# EAGLE design emonDCduo-ESP v1.1c (EAGLE 8.3.2)
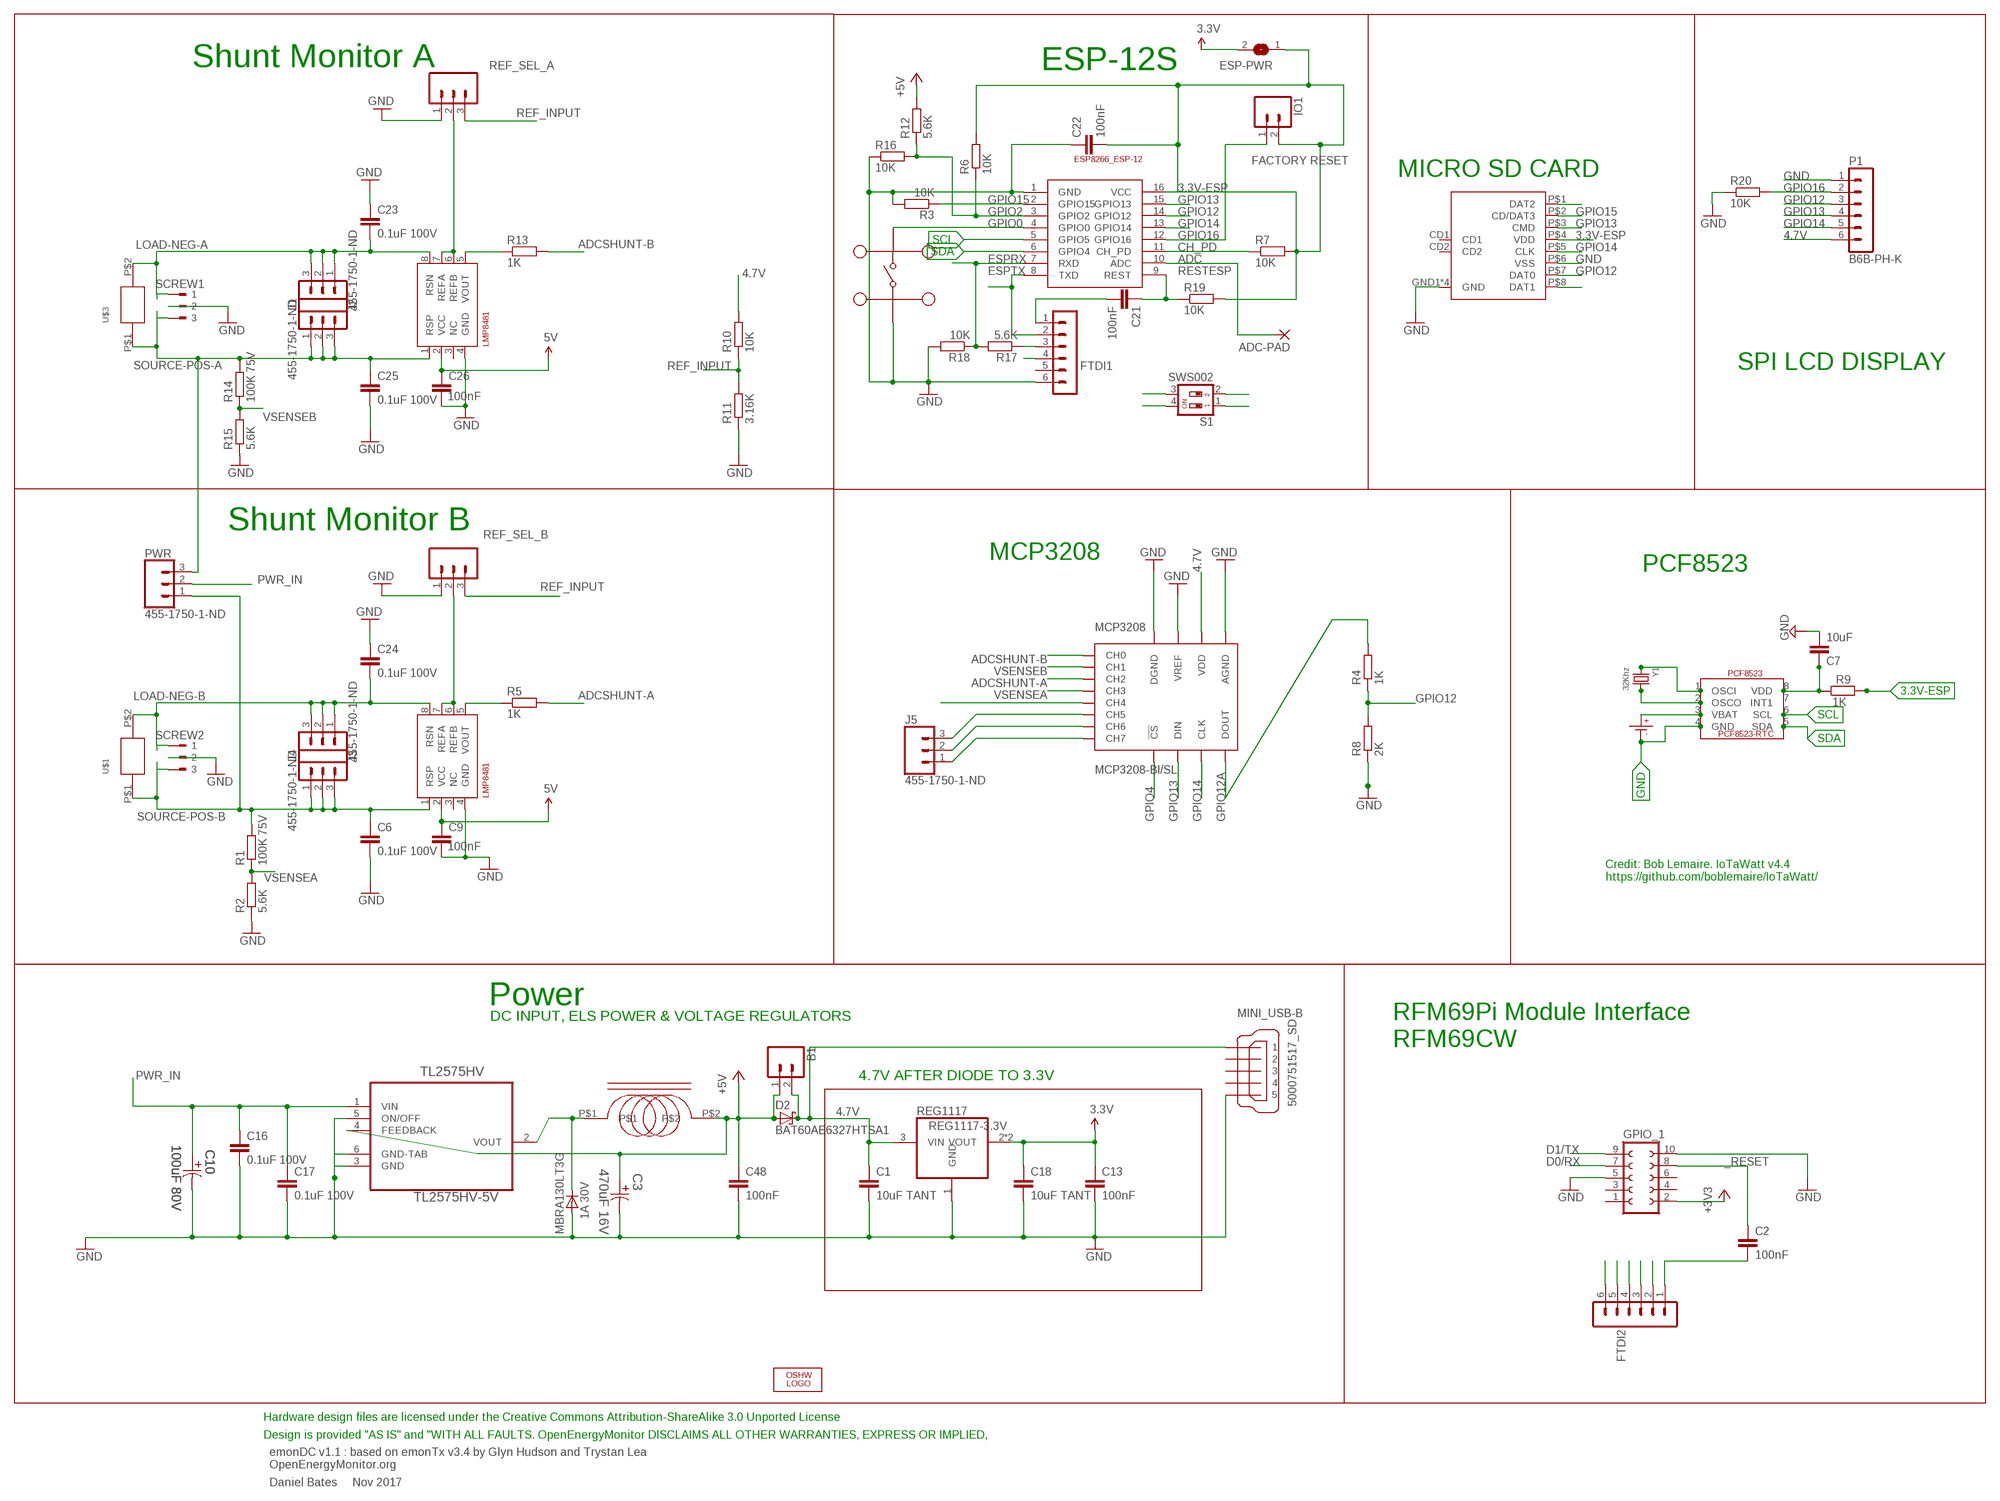
[diagram p0: schematic, sheet 1]

## Parts
ADC-PAD  2,15/1,0  [2,15/1,0]
B1  M02PTH  [1X02]
C1  10uF TANT  C-EUC0603  [C0603]
C2  100nF  C-EUC0603  [C0603]
C3  470uF 16V  EEE-FK1C471P-CASE-F  [CAPAE830X1050N]
C6  0.1uF 100V  C-EUC0603  [C0603]
C7  10uF  C-EUC0603  [C0603]
C9  100nF  C-EUC0603  [C0603]
C10  100uF 80V  EEV-FK1K101Q-CASE-H13  [CAPAE1350X1400N]
C13  100nF  C-EUC0603  [C0603]
C16  0.1uF 100V  C-EUC0603  [C0603]
C17  0.1uF 100V  C-EUC0603  [C0603]
C18  10uF TANT  C-EUC0603  [C0603]
C21  100nF  C-EUC0603  [C0603]
C22  100nF  C-EUC0603  [C0603]
C23  0.1uF 100V  C-EUC0603  [C0603]
C24  0.1uF 100V  C-EUC0603  [C0603]
C25  0.1uF 100V  C-EUC0603  [C0603]
C26  100nF  C-EUC0603  [C0603]
C48  100nF  C-EUC0603  [C0603]
CR1220  CR1220SMD  [CR1220SMD]
D1  MBRA130LT3G  [DO-214]
D2  BAT60AE6327HTSA1  BAT60J  [SOD323_ST]
ESP-12  ESP8266_ESP-12  [ESP8266-ESP12]
ESP-PWR  SJ  [SJ]
FTDI1  FTDI  MA06-1  [MA06-1]
FTDI2  FTDI  MA06-1  [MA06-1]
GPIO_1  FE05-2  [FE05-2]
I1  330uH  SRR0603-331KL  [SRR0603-331KL]
IO1  M02PTH  [1X02]
J1  455-1750-1-ND  CONN_03  [1X03]
J2  455-1750-1-ND  CONN_03  [1X03]
J3  455-1750-1-ND  CONN_03  [1X03]
J4  455-1750-1-ND  CONN_03  [1X03]
J5  455-1750-1-ND  CONN_03  [1X03]
LOGO1  OSHW_LOGO_6MILX0200-NT  [OSHW_6X200_NOTEXT]
MC2  MC32882  [SWITCH_TACT_MULTICOMP]
MCP3208  MCP3208-BI/SL  [SOIC16]
MINI_USB-B  5000751517_SD  [5000751517_SD]
P1  B6B-PH-K  [B6B-PH-K]
PCF8523  PCF8523_RTC  [SOIC_8]
PWR  455-1750-1-ND  CONN_03  [1X03]
R1  100K 75V  R-EU_R0603  [R0603]
R2  5.6K  R-EU_R0603  [R0603]
R3  10K  R-EU_R0603  [R0603]
R4  1K  R-EU_R0603  [R0603]
R5  1K  R-EU_R0603  [R0603]
R6  10K  R-EU_R0603  [R0603]
R7  10K  R-EU_R0603  [R0603]
R8  2K  R-EU_R0603  [R0603]
R9  1K  R-EU_R0603  [R0603]
R10  10K  R-EU_0309/12  [0309/12]
R11  3.16K  R-EU_0309/12  [0309/12]
R12  5.6K  R-EU_R0603  [R0603]
R13  1K  R-EU_R0603  [R0603]
R14  100K 75V  R-EU_R0603  [R0603]
R15  5.6K  R-EU_R0603  [R0603]
R16  10K  R-EU_R0603  [R0603]
R17  5.6K  R-EU_R0603  [R0603]
R18  10K  R-EU_R0603  [R0603]
R19  10K  R-EU_R0603  [R0603]
R20  10K  R-EU_R0603  [R0603]
REF_SEL_A  455-1750-1-ND  CONN_03  [1X03]
REF_SEL_B  455-1750-1-ND  CONN_03  [1X03]
REG1117  REG1117-3.3V  REG1117-VOUT4  [SOT223]
S1  SWS002  [SMS-002]
SCREW1  180-3  [180-3]
SCREW2  180-3  [180-3]
SHUNTMON-A  LMP8481  LMP8481-H  [S-PDSO-G08]
SHUNTMON-B  LMP8481  LMP8481-H  [S-PDSO-G08]
TL2575HV  TL2575HV-5V  TL2575HV-05IKTTR  [TO-263]
U$1  EBW_SERIES_10.5MM  [EBW_SERIES_10.5MM]
U$2  MOLEX_MICRO_SD_1040310811  [MOLEX_MICROSD_EXPOSED]
U$3  EBW_SERIES_10.5MM  [EBW_SERIES_10.5MM]
Y1  32Khz  CRYSTAL8X3.8SMT  [CRYSTAL_8X3.8]

## Nets
3.3V: C13.1 C18.1 ESP-PWR.2 GPIO_1.2 REG1117.2(VOUT) REG1117.4(VOUT) ; supply symbol labelled +3V3
3.3V-ESP: C22.2 ESP-12.16(VCC) ESP-PWR.1 IO1.2 R6.2 R7.2 R9.2 R19.2 U$2.P$4(VDD)
4.7V [power]: B1.2 C1.1 C9.1 C26.1 D2.C FTDI1.4 FTDI2.4 MCP3208.16(VDD) MINI_USB-B.VBUS P1.6 R10.2 REG1117.3(VIN) SHUNTMON-A.2(VCC) SHUNTMON-B.2(VCC) ; supply symbol labelled 5V
+5V: B1.1 C3.1 C48.1 D2.A I1.P$2 R12.2 TL2575HV.4(FEEDBACK)
_RESET: C2.1 GPIO_1.8
ADC: ADC-PAD.1(P) ESP-12.10(ADC)
ADCSHUNT-A: MCP3208.3(CH2) R5.2
ADCSHUNT-B: MCP3208.1(CH0) R13.2
CH_PD: ESP-12.11(CH_PD) R7.1
D0/RX: FTDI2.2 GPIO_1.7 S1.2
D1/TX: FTDI2.3 GPIO_1.9 S1.1
ESPRX: ESP-12.7(RXD) R17.2 R18.1 S1.4
ESPTX: ESP-12.8(TXD) FTDI1.2 S1.3
GND [thin_power]: C1.2 C3.2 C6.2 C7.2 C9.2 C10.2 C13.2 C16.2 C17.2 C18.2 C22.1 C23.1 C24.1 C25.2 C26.2 C48.2 CR1220.P-(P$-) D1.P$2(A) ESP-12.1(GND) FTDI1.6 FTDI2.6 GPIO_1.5 GPIO_1.10 MC2.P$1 MC2.P$2 MCP3208.9(DGND) MCP3208.14(AGND) MCP3208.15(VREF) MINI_USB-B.GND1 MINI_USB-B.GND2 MINI_USB-B.GND3 P1.1 PCF8523.4(GND) R2.1 R3.2 R8.1 R11.1 R15.1 R16.1 R18.2 R20.1 REF_SEL_A.1 REF_SEL_B.1 REG1117.1(GND) SCREW1.2 SCREW2.2 SHUNTMON-A.4(GND) SHUNTMON-B.4(GND) TL2575HV.3(GND) TL2575HV.5(ON/OFF) TL2575HV.6(GND-TAB) U$2.GND1(GND) U$2.GND2(GND) U$2.GND3(GND) U$2.GND4(GND) U$2.P$6(VSS)
GPIO0: ESP-12.4(GPIO0) MC2.P$3 MC2.P$4
GPIO2: ESP-12.3(GPIO2) R6.1 R12.1 R16.2
GPIO4: MCP3208.10(!CS)
GPIO12: ESP-12.14(GPIO12) P1.3 R4.1 R8.2 U$2.P$7(DAT0)
GPIO12A: MCP3208.12(DOUT) R4.2
GPIO13: ESP-12.15(GPIO13) MCP3208.11(DIN) P1.4 U$2.P$3(CMD)
GPIO14: ESP-12.13(GPIO14) MCP3208.13(CLK) P1.5 U$2.P$5(CLK)
GPIO15 [thin_power]: ESP-12.2(GPIO15) R3.1 U$2.P$2(CD/DAT3)
GPIO16: ESP-12.12(GPIO16) IO1.1 P1.2 R20.2
IND: D1.P$1(C) I1.P$1 TL2575HV.2(VOUT)
LOAD-NEG-A: C23.2 J1.1 J1.2 J1.3 SCREW1.1 SHUNTMON-A.8(RSN) U$3.P$2
LOAD-NEG-B: C24.2 J4.1 J4.2 J4.3 SCREW2.1 SHUNTMON-B.8(RSN) U$1.P$2
N$3: J5.3 MCP3208.6(CH5)
N$4: R13.1 SHUNTMON-A.5(VOUT)
N$5: J5.2 MCP3208.7(CH6)
N$6: R5.1 SHUNTMON-B.5(VOUT)
N$7: U$2.P$1(DAT2)
N$9: J5.1 MCP3208.8(CH7)
N$10: C7.1 PCF8523.8(VDD) R9.1
N$20: FTDI2.5
N$30: C21.2 FTDI1.1
N$32: U$2.P$8(DAT1)
N$36: FTDI1.3 R17.1
N$43: CR1220.P+(P$+) PCF8523.3(VBAT)
N$44: PCF8523.2(OSCO) Y1.P$4
N$45: PCF8523.1(OSCI) Y1.P$1
N$301: C2.2 FTDI2.1
PWR_IN: C10.1 C16.1 C17.1 PWR.2 TL2575HV.1(VIN)
REF_A_INPUT: REF_SEL_A.2 SHUNTMON-A.6(REFB) SHUNTMON-A.7(REFA)
REF_B_INPUT [thin_power]: REF_SEL_B.2 SHUNTMON-B.6(REFB) SHUNTMON-B.7(REFA)
REF_INPUT: MCP3208.5(CH4) R10.1 R11.2 REF_SEL_A.3 REF_SEL_B.3
RESTESP: C21.1 ESP-12.9(REST) R19.1
SCL: ESP-12.5(GPIO5) PCF8523.6(SCL)
SDA: ESP-12.6(GPIO4) PCF8523.5(SDA)
SOURCE-POS-A: C25.1 J2.1 J2.2 J2.3 PWR.3 R14.2 SCREW1.3 SHUNTMON-A.1(RSP) U$3.P$1
SOURCE-POS-B: C6.1 J3.1 J3.2 J3.3 PWR.1 R1.2 SCREW2.3 SHUNTMON-B.1(RSP) U$1.P$1
VSENSEA: MCP3208.4(CH3) R1.1 R2.2
VSENSEB: MCP3208.2(CH1) R14.1 R15.2
Unconnected: FTDI1.5 GPIO_1.1 GPIO_1.3 GPIO_1.4 GPIO_1.6 MINI_USB-B.D+ MINI_USB-B.D- MINI_USB-B.ID PCF8523.7(INT1) SHUNTMON-A.3(NC) SHUNTMON-B.3(NC) U$2.CD1 U$2.CD2

## Notes on the sheet
- Shunt Monitor A | ESP-12S
- FACTORY RESET
- MICRO SD CARD
- SPI LCD DISPLAY
- Shunt Monitor B
- MCP3208
- PCF8523
- Credit: Bob Lemaire. IoTaWatt v4.4
  https://github.com/boblemaire/IoTaWatt/
- Power
- DC INPUT, ELS POWER & VOLTAGE REGULATORS
- RFM69Pi Module Interface
  RFM69CW
- 4.7V AFTER DIODE TO 3.3V
- Hardware design files are licensed under the Creative Commons Attribution-ShareAlike 3.0 Unported License
- Design is provided "AS IS" and "WITH ALL FAULTS. OpenEnergyMonitor DISCLAIMS ALL OTHER WARRANTIES, EXPRESS OR IMPLIED,
- emonDC v1.1 : based on emonTx v3.4 by Glyn Hudson and Trystan Lea
  OpenEnergyMonitor.org
- Daniel Bates     Nov 2017

## Library data of the parts
ADC-PAD = wirepad:2,15/1,0: THROUGH-HOLE PAD
B1 IO1 = SparkFun:M02: Header 2 Standard 2-pin 0.1" header. Use with straight break away headers (SKU : PRT-00116), right angle break away headers (PRT-00553), swiss pins (PRT-00743), machine pins (PRT-00117), and female headers (PRT-00115). Molex polarized connector foot print use with SKU : PRT-08233 with associated crimp pins and housings.
C1 C2 C7 C13 C16-C18 C21 C22 C48 = rcl:C-EU: CAPACITOR, European symbol
C3 = Panasonic-EEEFK_EEEFP:EEE-: Aluminum Electrolytic Capacitors,Surface Mount Type; MPN: EEE-FK1C471P; OC_FARNELL: 9695710; OC_NEWARK: 96K9385; PACKAGE: CASE-F; SUPPLIER: PANASONIC; TOLERANCE: ±20 %; VALUE: 470UF; VOLTAGERATING: 16V
C6 C9 C23-C26 = rcl:C-EU: CAPACITOR, European symbol; MPN: C1608X7S2A104K080AB
C10 = Panasonic-EEE-EEV-EEF-ECQ:EEV-: Aluminum Electrolytic Capacitors,Surface Mount Type; MPN: EEVFK1K101Q; OC_FARNELL: 9696113; OC_NEWARK: 96K9484; SUPPLIER: PANASONIC; TOLERANCE: ±20 %; VALUE: 100UF; VOLTAGERATING: 80V
CR1220 = IotaWatt_parts:CR1220SMD: CR1220 Battery SMD
D1 = CASE 403D Diode:MBRA130LT3G: Fast switching diode; MF: ON SEMICONDUCTOR; MPN: MBRA130LT3G; OC_FARNELL: 9555978
D2 = diode:BAT60J: Schottky barrier diode Source: www.st.com, BAT60J.pdf
ESP-12 = ESP8266-ESP12:ESP8266_ESP-12
ESP-PWR = jumper:SJ: SMD solder JUMPER
FTDI1 FTDI2 = JeeLabs:MA06-1: PIN HEADER
GPIO_1 = con-lsta:FE05-2: FEMALE HEADER; OC_FARNELL: unknown; OC_NEWARK: unknown
I1 = SRR0603-331KL:SRR0603-331KL: SRR0603-331KL; INDUCTANCE: 330uH; MF: BOURNS; MPN: SRR0603-331KL; OC_FARNELL: 2333890
J1-J5 PWR = SparkFun-Connectors:CONN_03: Multi connection point. Often used as Generic Header-pin footprint for 0.1 inch spaced/style header connections On any of the 0.1 inch spaced packages, you can populate with these: Break Away Headers - Straight <https://www.sparkfun.com/products/116> (PRT-00116) Break Away Male Headers - Right Angle <https://www.sparkfun.com/products/553> (PRT-00553) Female Headers <https://www.sparkfun.com/products/115> (PRT-00115) Break Away Headers - Machine Pin <https://www.sparkfun.com/products/117> (PRT-00117) Break Away Female Headers - Swiss Machine Pin <https://www.sparkfun.com/products/743> (PRT-00743) Stackable Header - 3 Pin (Female, 0.1") <https://www.sparkfun.com/products/13875> (PRT-13875) For SCREWTERMINALS and SPRING TERMINALS visit here: Screw Terimnals on SparkFun.com <https://www.sparkfun.com/search/results?term=Screw+Terminals> (5mm/3.5mm/2.54mm spacing) This device is also useful as a general connection point to wire up your design to another part of your project. Our various solder wires solder well into these plated through hole pads. Hook-Up Wire - Assortment (Stranded, 22 AWG) <https://www.sparkfun.com/products/11375> (PRT-11375) Hook-Up Wire - Assortment (Solid Core, 22 AWG) <https://www.sparkfun.com/products/11367> (PRT-11367) View the entire wire category on our website here <https://www.sparkfun.com/categories/141> Special notes: Molex polarized connector foot print use with SKU : PRT-08232 with associated crimp pins and housings.; PROD_ID: XXX-00000
LOGO1 = ohw-logo:OSHW_LOGO_6MIL; OC_FARNELL: unknown
MC2 = multicomp tact switch:MC32882
MCP3208 = MCP3208:MCP3208
MINI_USB-B = 5000751517_sd:5000751517_SD
P1 = jst-ph:B6B-PH-K: HEADER
PCF8523 = IotaWatt_parts:PCF8523_RTC: PCF8523-RTC SOIC-8
R1 R14 = rcl:R-EU_: RESISTOR, European symbol; MPN: MCWR06X1003FTL
R2 R4 R8 R15 = rcl:R-EU_: RESISTOR, European symbol; MPN: MCWR06X5901FTL
R3 R5-R7 R9-R13 R16-R20 = rcl:R-EU_: RESISTOR, European symbol
REF_SEL_A REF_SEL_B = SparkFun-Connectors:CONN_03: Multi connection point. Often used as Generic Header-pin footprint for 0.1 inch spaced/style header connections On any of the 0.1 inch spaced packages, you can populate with these: Break Away Headers - Straight <https://www.sparkfun.com/products/116> (PRT-00116) Break Away Male Headers - Right Angle <https://www.sparkfun.com/products/553> (PRT-00553) Female Headers <https://www.sparkfun.com/products/115> (PRT-00115) Break Away Headers - Machine Pin <https://www.sparkfun.com/products/117> (PRT-00117) Break Away Female Headers - Swiss Machine Pin <https://www.sparkfun.com/products/743> (PRT-00743) Stackable Header - 3 Pin (Female, 0.1") <https://www.sparkfun.com/products/13875> (PRT-13875) For SCREWTERMINALS and SPRING TERMINALS visit here: Screw Terimnals on SparkFun.com <https://www.sparkfun.com/search/results?term=Screw+Terminals> (5mm/3.5mm/2.54mm spacing) This device is also useful as a general connection point to wire up your design to another part of your project. Our various solder wires solder well into these plated through hole pads. Hook-Up Wire - Assortment (Stranded, 22 AWG) <https://www.sparkfun.com/products/11375> (PRT-11375) Hook-Up Wire - Assortment (Solid Core, 22 AWG) <https://www.sparkfun.com/products/11367> (PRT-11367) View the entire wire category on our website here <https://www.sparkfun.com/categories/141> Special notes: Molex polarized connector foot print use with SKU : PRT-08232 with associated crimp pins and housings.; MF: MULTICOMP; MPN: 2212S-02SG-85; OC_FARNELL: 1593458; PROD_ID: XXX-00000
REG1117 = burr-brown:REG1117-VOUT4: 800mA and 1A Low Dropout (LDO) Positive Regulator 1.8V, 2.5V, 2.85V, 3.3V, 5V, and Adj; MF: TEXAS INSTRUMENTS; MPN: REG1117; OC_FARNELL: 1097566; OC_NEWARK: 14P6981
S1 = smd-special:SWS002: SMD Dip Switch 2 pol.
SCREW1 SCREW2 = con-weidmueller-sl35:180-3: WEIDMUELLER CLAMP CONNECTOR; OC_FARNELL: unknown; OC_NEWARK: unknown
SHUNTMON-A = lmp8481b:LMP8481: LMP8481MM-H/NOPB 100V/V; MF: TEXAS INSTRUMENTS; MPN: LMP8481MME-S/NOPB; OC_FARNELL: 2322044
SHUNTMON-B = lmp8481b:LMP8481: LMP8481MM-H/NOPB 100V/V; MF: TEXAS INSTRUMENTS; MPN: LMP8481MME-H/NOPB; OC_FARNELL: 2322044
TL2575HV = TL2575HV:TL2575HV; MF: TEXAS INSTRUMENTS; MPN: LM2575HVS-15/NOPB; OC_FARNELL: 2492609
U$1 U$3 = EBW series shunt:EBW_SERIES_10.5MM
U$2 = MOLEX MICRO SD [exposed pins]:MOLEX_MICRO_SD_1040310811
Y1 = microbuilder:CRYSTAL: Crystals HC49UP - Surface Mount Crystal 4.0MHz 18pF +/-30ppm Surface Mount Crystal [Digikey: 535-9857-1-ND] 12.0 MHz Surface Mount Crystal [Digikey: 535-9869-6-ND] 25.0 MHz Surface Mount Crystal [Digikey: 535-9078-1-ND] 2.5 x 2.0mm - MEMs SMT Crystal 16.0 MHz 10pF 20ppm 2.5 x 2.0mm Crystal [Digikey -40-85°C: 535-10923-1-ND] 3.2 x 2.5mm - MEMs SMT Crystal 12.0 MHz 8pF 15ppm 3.2 x 2.5mm Crystal [Digikey: -10-70°C: 644-1047-1-ND -40-125°C: 644-1128-1-ND] 16.0 MHz 8pF 15ppm 3.2 x 2.5mm Crystal [Digikey: -10-70°C: 644-1049-1-ND -40-125°C: 644-1129-2-ND] 16.0 MHz 10pF 10ppm 3.2 x 2.5mm Crystal [Digikey: 644-1100-1-ND] 27.12 MHz 18pF 30ppm 3.2 x 2.5mm Crystal [Digikey: 887-1424-1-ND] 27.12MHz 10pF 10ppm 3.2 x 2.5mm Crystal [Digikey: 887-1329-1-ND] 4.9 x 1.8mm - MEMs SMT Crystal 32.768 KHz 12.5pF 20ppm 4.9 x 1.8mm Crystal [Digikey: SE2415CT-ND] 8.0 x 3.8mm - Surface Mount Crystal 32.768kHz 12.5pF 20ppm -40°C-85°C [Digikey: 535-9166-2-ND] Cylinder 32.768KHz Cylinder Crystal (2x6mm body) [Ex. Digikey: 300-8341-2-ND]

## Net classes
2 thin_power: width 0.254 mm

## Board
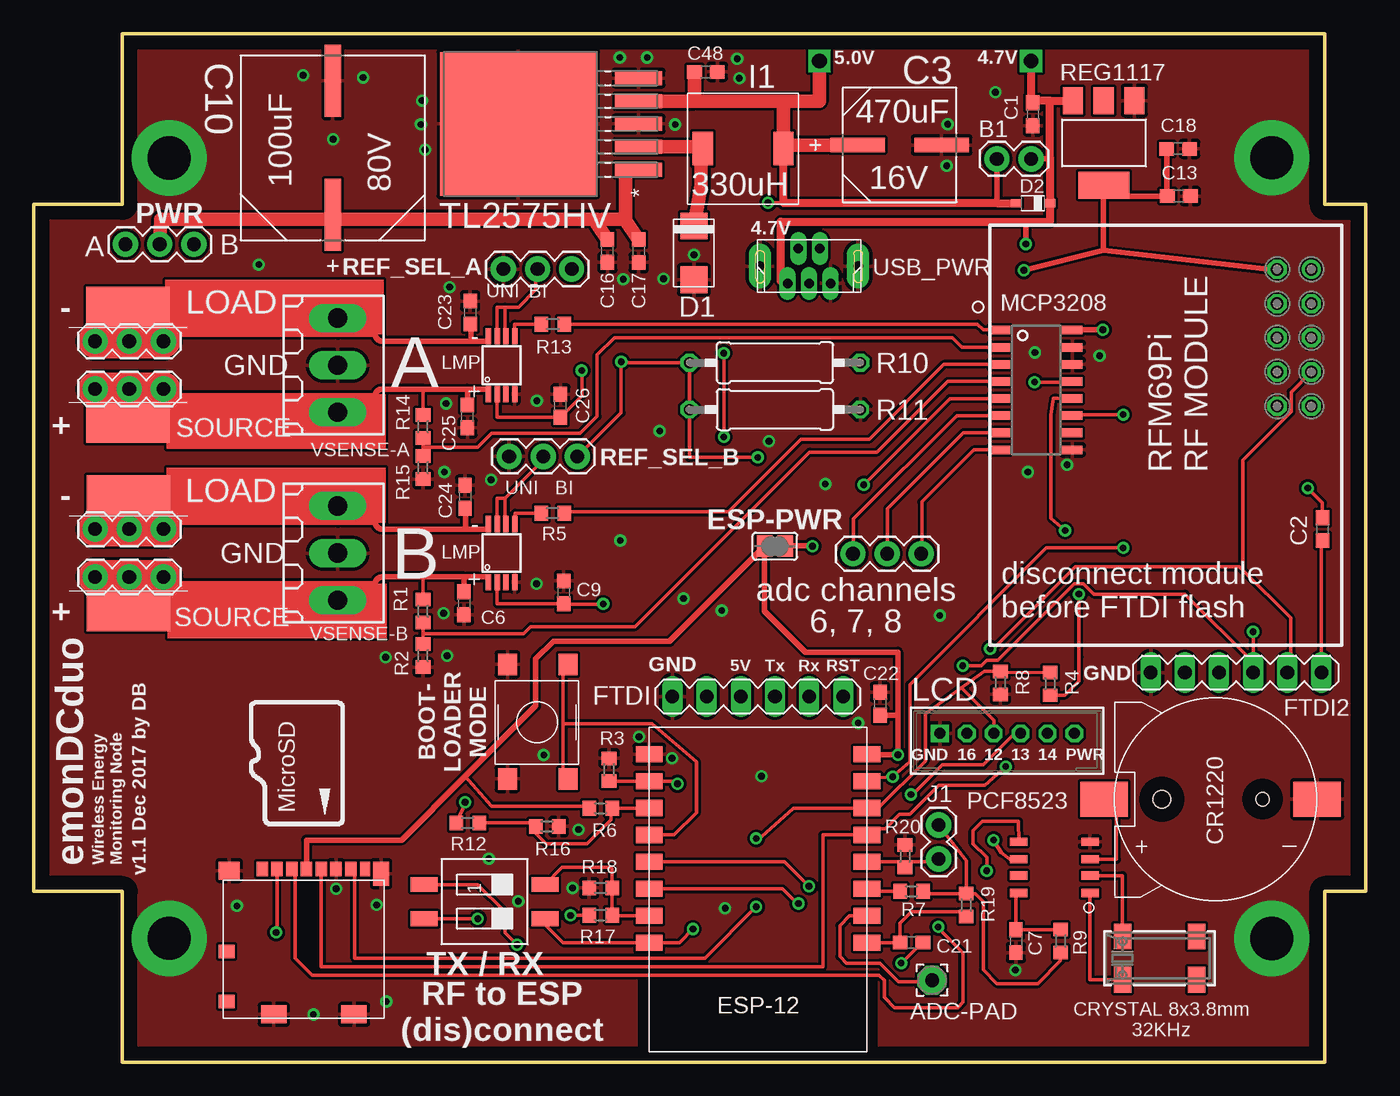
[diagram p1: board, top side]
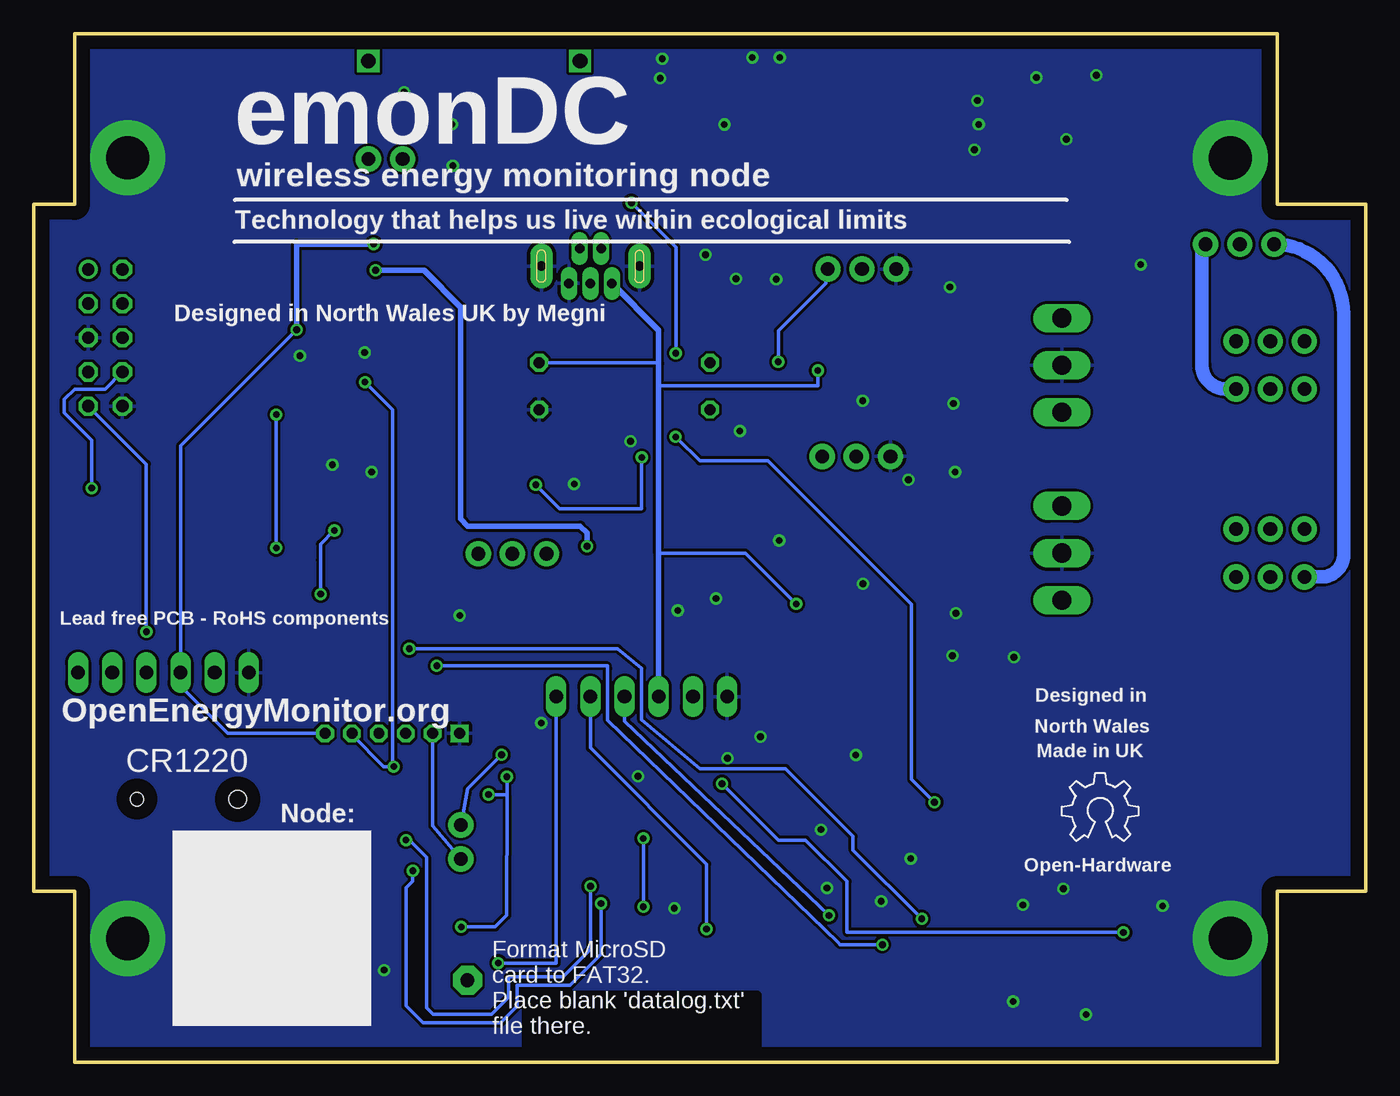
[diagram p2: board, bottom side, seen from below]

Size 99.06 x 76.45 mm. Coordinates in mm from the lower left corner, seen from the top.
Outline: 6.6,63.75 6.6,76.45 96.01,76.45 96.01,63.75 99.06,63.75 99.06,12.7 96.01,12.7 96.01,0 6.6,0 6.6,12.7 0,12.7 0,63.75 6.6,63.75
Copper layers (1*16): Top 0.035mm / dielectric 1.5mm / Bottom 0.035mm
Design rules "default *": minimum track width 10mil, minimum drill 19mil, track to track 8mil, track to pad 8mil, pad to pad 8mil, via to via 8mil, smd to smd 8mil, copper to edge 40mil, drill to drill 8mil, minimum pad ring 10mil, minimum via ring 8mil, stop-mask expansion 4mil, vias tented up to drill 0mil, thermal gap 10mil
tRestrict: area 45.2,1 to 62.5,6.1
bRestrict: area 45.2,1 to 62.5,5.1

### Footprints (pad centres in the part's own frame; a part is rotated, then mirrored left to right if it is on the bottom)
2,15/1,0 = drill 1.016 pad 2.159 octagon: 1 0,0
1X02 = drill 1.016 pad 1.88: 1 0,0; 2 2.54,0
C0603 = smd 1.1 x 1: 1 -0.85,0; 2 0.85,0
CAPAE830X1050N = smd 4.064 x 1.092: 1 -3.124,0; 2 3.124,0
CAPAE1350X1400N = smd 5.359 x 1.194: 1 -4.978,0; 2 4.978,0
CR1220SMD = smd 3.54 x 2.6: P+ 8.3,0; P- -7.55,0 | hole 1: -3.5,0 | hole 1.3: 4,0
DO-214 = smd 2 x 2: P$1 -2,0; P$2 2,0
SOD323_ST = smd 0.8 x 0.6: A 1.25,0; C -1.25,0
ESP8266-ESP12 = smd 2 x 1.2: 1 16.2,2; 2 16.2,4; 3 16.2,6; 4 16.2,8; 5 16.2,10; 6 16.2,12; 7 16.2,14; 8 16.2,16; 9 0,16; 10 0,14; 11 0,12; 12 0,10; 13 0,8; 14 0,6; 15 0,4; 16 0,2
SJ = smd 1.168 x 1.6: 1 -0.762,0; 2 0.762,0
MA06-1 = drill 1.016 long: 1 0,0; 2 2.54,0; 3 5.08,0; 4 7.62,0; 5 10.16,0; 6 12.7,0
FE05-2 = drill 0.914: 1 -5.08,1.27 | drill 0.914 octagon: 2 -5.08,-1.27; 3 -2.54,1.27; 4 -2.54,-1.27; 5 0,1.27; 6 0,-1.27; 7 2.54,1.27; 8 2.54,-1.27; 9 5.08,1.27; 10 5.08,-1.27
SRR0603-331KL = smd 1.5 x 2.5: P$1 -3,0; P$2 3,0
1X03 = drill 1.016 pad 1.88: 1 0,0; 2 2.54,0; 3 5.08,0
SWITCH_TACT_MULTICOMP = smd 1.6 x 1.4: P$1 -1.1,5.3; P$2 7.4,5.3; P$3 -1.1,0.8; P$4 7.4,0.8
SOIC16 = smd 0.635 x 1.524: 1 -4.445,-2.695; 2 -3.175,-2.695; 3 -1.905,-2.695; 4 -0.635,-2.695; 5 0.635,-2.695; 6 1.905,-2.695; 7 3.175,-2.695; 8 4.445,-2.695; 9 4.445,2.695; 10 3.175,2.695; 11 1.905,2.695; 12 0.635,2.695; 13 -0.635,2.695; 14 -1.905,2.695; 15 -3.175,2.695; 16 -4.445,2.695
5000751517_SD = drill 0.7 pad 1.016 long: D+ 0,-1.3; D- -0.8,1.3; GND1 1.6,-1.3; ID 0.8,1.3; VBUS -1.6,-1.3 | drill 0.7 pad 1.676 long: GND2 3.65,0; GND3 -3.65,0
B6B-PH-K = drill 0.813 square: 1 -5,0 | drill 0.813 octagon: 2 -3,0; 3 -1,0; 4 1,0; 5 3,0; 6 5,0
SOIC_8 = smd 1.3 x 0.6: 1 -2.6,1.9; 2 -2.6,0.6; 3 -2.6,-0.6; 4 -2.6,-1.9; 5 2.7,-1.9; 6 2.7,-0.6; 7 2.7,0.6; 8 2.7,1.9
R0603 = smd 1 x 1.1: 1 -0.85,0; 2 0.85,0
0309/12 = drill 0.813 octagon: 1 -6.35,0; 2 6.35,0
SOT223 = smd 1.499 x 2.007: 1 -2.261,-3.15; 2 0.025,-3.15; 3 2.311,-3.15 | smd 3.81 x 2.007: 4 0,3.15
SMS-002 = smd 1.092 x 2.007: 1 -1.27,-4.496; 2 1.27,-4.496; 3 1.27,4.496; 4 -1.27,4.496
180-3 = drill 1.422 long: 1 -3.5,0; 2 0,0; 3 3.5,0
S-PDSO-G08 = smd 0.4 x 1.2: 1 -0.975,-2.157; 2 -0.325,-2.157; 3 0.325,-2.157; 4 0.975,-2.157; 5 0.975,2.157; 6 0.325,2.157; 7 -0.325,2.157; 8 -0.975,2.157
TO-263 = smd 1.041 x 3.505: 1 -3.404,-8.788; 2 -1.702,-8.788; 3 0,-8.788; 4 1.702,-8.788; 5 3.404,-8.788 | smd 10.668 x 11.659: 6 0,0.152
EBW_SERIES_10.5MM = smd 3 x 6.2: P$1 -4.3,0; P$2 4.3,0
MOLEX_MICROSD_EXPOSED = smd 1.195 x 1.005: CD1 5.349,0.435; CD2 5.349,4.135 | smd 1.907 x 1.348: GND1 -4.112,5.104; GND2 1.853,5.104 | smd 1.17 x 1.793: GND3 -6.134,-5.352 | smd 1.551 x 1.348: GND4 5.167,-5.577 | smd 0.851 x 1.092: P$1 2.707,-5.703; P$2 1.617,-5.703; P$3 0.522,-5.699; P$4 -0.586,-5.701; P$5 -1.676,-5.703; P$6 -2.769,-5.703; P$7 -3.875,-5.701 | smd 0.749 x 1.092: P$8 -4.935,-5.701
CRYSTAL_8X3.8 = smd 1.3 x 1.9: P$1 -2.75,-1.6; P$2 2.75,-1.6; P$3 2.75,1.6; P$4 -2.75,1.6

### Placement (x,y rotation side)
ADC-PAD  66.8,6.1 0 top
B1  71.63,67.14 0 top
C1  74.3,70.46 270 top
C2  95.83,39.63 270 top
C3  64.39,68.17 0 top
C6  32,34.11 270 top
C7  73.04,9 270 top
C9  39.42,34.93 90 top
C10  22.25,67.96 90 top
C13  85.15,64.38 0 top
C16  42.66,60.3 270 top
C17  44.99,60.3 270 top
C18  85.1,67.89 0 top
C21  65.28,8.89 0 top
C22  62.94,26.64 270 top
C23  32.46,55.73 270 top
C24  32.08,42.04 270 top
C25  32.26,48.01 270 top
C26  39.17,48.8 90 top
C48  49.99,73.61 0 top
CR1220  87.88,19.56 180 top
D1  49.09,60.16 270 top
D2  74.31,63.85 180 top
ESP-12  61.98,24.89 180 top
ESP-PWR  55.12,38.35 0 top
FTDI1  60.2,27.18 180 top
FTDI2  95.76,28.96 180 top
GPIO_1  93.73,53.85 270 top
I1  52.76,67.91 0 top
IO1  67.29,15.1 90 top
J1  4.57,53.59 0 top
J2  4.57,50.04 0 top
J3  4.57,36.07 0 top
J4  4.57,39.62 0 top
J5  66,37.79 180 top
LOGO1  22.6,16.43 0 bottom
MC2  40.53,22.17 90 top
MCP3208  74.54,49.96 270 top
MINI_USB-B  57.66,59.18 0 top
P1  72.39,24.44 0 top
PCF8523  75.95,14.48 180 top
PWR  6.84,60.8 0 top
R1  28.96,33.53 90 top
R2  28.96,30.23 90 top
R3  42.79,21.74 90 top
R4  75.57,28.13 270 top
R5  38.6,40.81 0 top
R6  42.16,18.87 180 top
R7  65.28,12.7 0 top
R8  71.88,28.19 90 top
R9  76.36,9.01 270 top
R10  55.12,52 0 top
R11  55.12,48.51 180 top
R12  32.28,17.78 180 top
R13  38.61,54.86 0 top
R14  28.96,47.24 90 top
R15  28.96,44.2 90 top
R16  38.19,17.53 180 top
R17  42.16,10.92 0 top
R18  42.16,12.95 180 top
R19  69.34,11.68 90 top
R20  64.79,15.31 270 top
REF_SEL_A  34.92,58.95 0 top
REF_SEL_B  35.35,45.03 0 top
REG1117  79.58,68.33 180 top
S1  33.53,11.94 270 top
SCREW1  22.61,51.82 270 top
SCREW2  22.61,37.85 270 top
SHUNTMON-A  34.8,51.82 0 top
SHUNTMON-B  34.8,37.85 0 top
TL2575HV  36.19,69.74 90 top
U$1  7.05,37.82 90 top
U$2  19.71,8.66 180 top
U$3  7.02,51.83 90 top
Y1  83.71,7.73 0 top

### Tracks (layer width: path | path; a pad name or v marks a point on that pad's centre or on a via)
3.3V  (via drill 0.5)
  Top 0.254: 55.94,38.39 ESP-PWR.2 | 92.46,58.86 GPIO_1.2
  Top 0.406: REG1117.2 79.54,71.48 | 79.54,60.37 92.46,58.86 | 79.54,60.37 v73.63,58.86 | C18.1 84.25,64.44 C13.1 79.58,64.38 REG1117.4 79.54,65.13 79.54,60.37 | v57.91,38.35 57.88,38.39 55.94,38.39
  Bottom 0.406: v73.63,58.86 70.04,58.86 67.31,56.13 67.31,40.39 66.78,39.85 58.42,39.85 57.91,39.34 v57.91,38.35
3.3V-ESP  (via drill 0.5)
  Top 0.254: R7.2 66.13,12.53 R19.2 | R6.2 40.89,19.04 34.05,19.04 32.09,21.25 | IO1.2 69.34,14.99 R19.2 | R19.2 70.02,12.53 70.61,11.94 70.61,6.86 71.63,5.84 74.68,5.84 76.36,7.53 R9.2
  Top 0.406: 64.26,25.91 64.26,30.48 57.4,30.48 54.36,33.53 ESP-PWR.1 47.29,31.28 38.65,31.28 37.34,29.97 37.34,26.49 32.09,21.25 27.35,16.51 20.3,16.51 U$2.P$4 | 64.26,25.91 v64.26,22.86 62.01,22.86 ESP-12.16 | C22.2 64.15,25.8 64.26,25.91
  Bottom 0.254: v64.26,22.86 66.8,20.32 IO1.2
4.7V  (via drill 0.5, 1.1)
  Top 0.254: SHUNTMON-A.2 34.47,47.95 C26.1 40.76,49.54 40.76,51.36 40.75,51.36 v40.75,51.41 | SHUNTMON-B.2 34.47,34.08 C9.1 39.46,34.04 42.42,34.04 42.39,34.07 v42.36,34.07
  Top 0.406: D2.C 75.74,64.1 | 74.17,71.31 C1.1 74.3,71.48 | 75.56,62.48 73.79,62.48 v73.79,60.81 | v79.5,54.44 77.27,54.44 MCP3208.16 | MINI_USB-B.VBUS 55.86,58.08 55.56,58.08 | B1.2 75.4,67.14 75.56,67.31
  Top 0.61: v74.17,74.42 74.17,71.31 | 75.56,71.48 75.56,67.31 D2.C 75.56,62.48 55.56,62.48 55.56,58.08 | 75.56,71.48 REG1117.3 | 75.56,71.48 74.3,71.48
  Bottom 0.254: 40.85,51.31 v40.75,51.41 40.75,50.29 52.58,50.29 52.58,51.94 52.58,52 R10.2 | v42.36,34.07 46.14,37.85 52.58,37.85 | v79.5,54.44 88.14,45.81 FTDI2.4 88.14,27.94 84.64,24.44 P1.6
  Bottom 0.406: v79.5,54.44 79.5,60.81 v73.79,60.81 | FTDI1.4 52.58,37.85 52.58,51.94 52.58,54.4 MINI_USB-B.VBUS
+5V  (via drill 0.5, 1.1)
  Top 0.254: v54.61,63.88 55.72,63.88 55.76,63.85 | R12.2 32.07,19.16 v32.08,19.33 | v51.32,46.48 51.32,52.69 v51.31,52.7
  Top 0.406: B1.1 71.63,63.85
  Top 0.61: D2.A 71.63,63.85 55.76,63.85 I1.P$2
  Top 1.016: TL2575HV.4 49.14,71.44 | 49.14,71.44 C48.1 | 55.76,71.44 I1.P$2 55.5,68.17 C3.1 | 55.76,71.44 49.14,71.44 | v58.42,74.42 58.42,71.44 55.76,71.44
  Bottom 0.254: v51.32,46.48 51.18,46.36 49.53,44.7 44.45,44.7 33.78,34.04 33.78,21.03 v32.08,19.33 | v51.31,52.7 51.31,60.58 v54.61,63.88
_RESET  (via drill 0.5)
  Top 0.254: C2.1 95.83,41.58 v94.74,42.67
  Bottom 0.254: v94.74,42.67 94.74,46.23 96.77,48.26 96.77,49.28 96.01,50.04 93.73,50.04 GPIO_1.8
ADC
  Top 0.254: ESP-12.10 60.68,10.89 59.94,10.16 59.94,7.87 60.45,7.37 62.93,7.37 64.3,5.99 66.7,5.99 ADC-PAD.1
ADCSHUNT-A
  Top 0.254: R5.2 39.43,40.93 51.66,40.93 57.05,46.32 62.14,46.32 67.69,51.88 71.82,51.88 MCP3208.3
ADCSHUNT-B
  Top 0.254: R13.2 70.18,54.86 70.6,54.44 71.81,54.44 MCP3208.1
CH_PD
  Top 0.254: ESP-12.11 61.98,12.7 R7.1
D0/RX  (via drill 0.5)
  Top 0.254: S1.2 v33.02,10.67 | v71.12,30.73 71.37,30.73 77.47,36.83 89.66,36.83 89.92,36.58 | 89.92,36.58 93.47,33.02 93.47,29.21 FTDI2.2 | GPIO_1.7 93.5,49.81 93.5,48.34 89.92,44.76 89.92,36.58
  Bottom 0.254: v33.02,10.67 38.13,15.77 38.13,16.79 43.16,21.82 49.52,21.82 53.86,25.46 53.86,29.29 55.63,30.73 v71.12,30.73
D1/TX  (via drill 0.5)
  Top 0.254: v69.09,29.46 70.47,29.46 70.88,29.87 71.69,29.87 77.4,35.58 78.05,35.58 78.82,34.8 85.6,34.8 90.68,29.72 FTDI2.3 v90.68,32 | v35.95,8.74 35.05,9.64 35.05,11.18 33.02,13.21 S1.1
  Bottom 0.254: v69.09,29.46 56.39,29.46 56.38,29.26 56.38,25.43 39.22,8.87 39.1,8.74 v35.95,8.74 | v90.68,32 90.68,44.45 GPIO_1.9
ESPRX
  Top 0.254: ESP-12.7 42.79,10.89 R17.2 R18.1 43.01,14.39 42.93,14.48 39.29,14.48 S1.4
ESPTX  (via drill 0.5)
  Top 0.254: S1.3 38.02,10.24 39.37,8.89 ESP-12.8 48.01,8.89 v49.02,9.91
  Bottom 0.254: v49.02,9.91 49.02,14.73 57.66,23.37 FTDI1.2
GND  (via drill 0.5, 3.2 pad 5.59)
  Top 0.254: ESP-12.1 46.06,22.61
  Top 0.406: U$2.GND2 | U$2.P$6 22.48,14.39 | 25.86,13.97 25.91,13.97 25.96,14.02
  other vias: 10.08,67.21 92.07,67.23 52.47,73.15 10.08,9.2 92.07,9.2 30.49,33.36 16.74,59.28 30.55,43.87 37.41,49.17 71.51,72.1 30.66,48.96 37.39,35.57 47.47,22.6 51.42,11.44 22.49,12.89 43.84,58.2 67.97,69.73 47.7,69.7 28.88,71.47 20.04,73.36 24.49,73.2 26.18,30.11 30.74,30.22 34.01,43.3 20.81,3.54 49.09,60.02 45.02,24.2 25.51,11.7 61.31,25.22 15.12,11.62 30.93,57.61 37.93,22.83 26.23,4.51 46.83,58.24 67.88,66.63 52.32,74.58 29.11,67.83 28.79,69.71 43.59,74.69 45.62,74.69 22.27,68.6 43.63,38.79 48.33,34.47 51.17,33.58 67.38,33.2 54.12,21.26 73.93,43.87 79.27,52.5 74.44,52.76 76.85,44.42 54.68,46.15 72.99,6.85 46.55,46.91 58.87,42.98 40.08,12.95 40.52,17.29 36.04,11.96 33.84,15.13
  pour Bottom (isolate 0.127): 6.86,76.2 6.86,63.5 0.25,63.5 0.25,12.95 6.86,12.95 6.86,0.25 95.76,0.25 95.76,12.95 98.81,12.95 98.81,63.5 95.76,63.5 95.76,76.2
  pour Top (isolate 0.127): 6.86,76.2 6.86,63.5 0.25,63.5 0.25,12.95 6.86,12.95 6.86,0.25 95.76,0.25 95.76,12.95 98.81,12.95 98.81,63.5 95.76,63.5 95.76,76.2
GPIO0
  Top 0.254: ESP-12.4 47.63,16.89 49.28,18.54 49.28,22.35 45.97,25.15 39.37,25.15 | 39.37,25.15 39.37,29.21 39.73,29.21 MC2.P$4 | 39.37,25.15 39.37,21.59 39.73,21.59 MC2.P$3
GPIO2
  Top 0.254: R16.2 | R16.2 37.34,17.02 38.1,16.26 41.15,16.26 42.93,18.03 42.93,18.78 R6.1 45.76,18.87 ESP-12.3 | R12.1 37.08,17.78 R16.2
GPIO12  (via drill 0.5)
  Top 0.254: R4.1 71.97,28.96 R8.2 70.7,29.04 68.99,27.83 | 68.99,27.83 66.29,25.91 66.29,22.38 62.77,18.86 61.98,18.86 ESP-12.14 56.48,18.89 53.78,16.45 | 53.78,16.45 53.59,16.51 | v53.72,11.56 49.91,7.75 23.88,7.75 23.88,14.1 U$2.P$7 | v53.72,16.64 53.85,16.64 53.78,16.45 | P1.3 71.39,25.42 68.99,27.83
  Bottom 0.254: v53.72,16.64 v53.72,11.56
GPIO12A  (via drill 0.5)
  Top 0.254: 77.22,49.34 MCP3208.12 76.1,49.34 75.83,49.34 75.64,48.14 75.64,40.45 76.69,39.52 v76.7,39.52 | v77.72,34.79 77.72,30.14 77.72,30.13 77.72,28.32 76.68,27.28 R4.2
  Bottom 0.254: v76.7,39.52 77.72,38.5 77.72,37.34 v77.72,34.79
GPIO13  (via drill 0.48, 0.5)
  Top 0.254: U$2.P$3 19.43,14.1 19.43,7.75 20.7,6.48 62.87,6.48 63.25,6.1 63.25,4.83 64.01,4.06 68.71,4.06 69.09,4.45 69.09,8.13 67.26,9.95 v67.26,10.06 | ESP-12.15 61.98,21.08 v63.87,21.22 65.15,22.35 65.15,28.07 75.31,38.23 v81.03,38.23 | v81.03,48.13 77.72,48.13 MCP3208.11 | v65.23,19.89 65.36,19.89 67.56,22.1 70.63,22.1 72.86,24.33 73.28,24.33 P1.4
  Bottom 0.254: 63.87,19.81 63.88,10.92 64.75,10.06 v67.26,10.06 | 63.87,19.81 v63.87,21.22 | v81.03,38.23 v81.03,48.13 | v65.23,19.89 63.96,19.89 63.87,19.81
GPIO14  (via drill 0.48)
  Top 0.254: ESP-12.13 58.67,16.89 58.67,7.11 21.39,7.11 U$2.P$5 | v74.42,50.55 77.22,50.55 MCP3208.13 | ESP-12.13 | v72.28,21.97 70.74,20.57 67.31,20.57 65.15,18.42 64.39,18.42 63.34,17.36 62.44,17.36 ESP-12.13
  Bottom 0.254: P1.5 75.39,24.34 73.02,21.97 v72.28,21.97 72.38,21.97 72.38,24.02 72.38,24.03 72.38,48.51 v74.42,50.55
GPIO15  (via drill 0.5)
  Top 0.254: ESP-12.2 R3.1 47.88,20.89 v47.88,20.7 | v18.03,9.65 18.09,9.65 U$2.P$2
  Bottom 0.254: v18.03,9.65 38.58,9.65 38.58,13.44 41.66,16.51 43.69,16.51 v47.88,20.7
GPIO16
  Top 0.254: IO1.1 66.71,14.89 64.95,14.89 | 64.95,14.89 ESP-12.12 | R20.2 64.95,14.62 64.95,14.89
  Bottom 0.254: P1.2 69.39,17.57 IO1.1
IND
  Top 1.016: TL2575HV.2 49.63,68.04 | 49.63,68.04 I1.P$1 | 49.63,68.04 49.63,65.1 D1.P$1
LOAD-NEG-A
  Top 0.406: 32.51,53.59 33.82,53.59 SHUNTMON-A.8 | C23.2 32.51,54.88 32.51,53.59 | 9.68,53.57 J1.3 arc-90 10.16,54.1 22.61,54.1 | SCREW1.1 22.61,54.1 | 22.61,54.1 25.4,54.1 arc90 25.91,53.59 32.51,53.59
  Top 2.54: J1.1 J1.2 | J1.2 J1.3 | U$3.P$2 7.02,53.69 J1.2
LOAD-NEG-B
  Top 0.406: 32.12,39.62 33.82,39.62 SHUNTMON-B.8 | C24.2 32.12,41.19 32.12,39.62 | J4.1 J4.2 J4.3 arc-90 10.16,40.13 22.61,40.13 | SCREW2.1 22.61,40.13 | 22.61,40.13 25.4,40.13 arc90 25.91,39.62 32.12,39.62
  Top 2.54: J4.1 J4.3 9.68,39.6 | J4.2 7.11,42.06 U$1.P$2
N$3
  Top 0.254: MCP3208.6 68.63,48.06 60.96,40.39 60.96,37.39 J5.3
N$4
  Top 0.254: SHUNTMON-A.5 35.77,54.86 R13.1
N$5
  Top 0.254: MCP3208.7 69.14,46.79 63.5,41.15 63.5,37.39 J5.2
N$6
  Top 0.254: SHUNTMON-B.5 35.81,40.81 R5.1
N$9
  Top 0.254: MCP3208.8 69.9,45.52 66.04,41.66 66.04,37.39 J5.1
N$10
  Top 0.254: R9.1 73.05,9.86 C7.1 73.04,12.53 PCF8523.8
N$30  (via drill 0.5)
  Top 0.254: v64.52,7.37 66.04,8.89 C21.2
  Bottom 0.254: FTDI1.1 60.2,7.37 v64.52,7.37
N$36  (via drill 0.5)
  Top 0.254: R17.1 v39.92,10.91
  Bottom 0.254: v39.92,10.91 55.12,25.36 FTDI1.3
N$43
  Top 0.254: PCF8523.3 80.52,15.08 80.52,19.3 79.58,19.3 CR1220.P+
N$44
  Top 0.254: PCF8523.2 80.96,13.88 Y1.P$4
N$45
  Top 0.254: PCF8523.1 78.55,6.13 Y1.P$1
N$301
  Top 0.254: FTDI2.1 95.76,38.35 95.83,38.43 C2.2
PWR_IN
  Top 1.016: 44.27,66.33 TL2575HV.1 44.01,66.33 44.01,62.66 43.94,62.66 | PWR.2 9.46,62.66 21.93,62.66 | 43.94,62.66 42.29,62.66 41.9,62.27 | C16.1 41.9,62.27 | C17.1 43.97,62.63 43.94,62.66 | 21.93,62.66 C10.1 | 41.9,62.27 41.9,62.66 21.93,62.66
REF_A_INPUT
  Top 0.254: 35.05,56.13 35.05,54.04 SHUNTMON-A.6 | SHUNTMON-A.7 34.47,56.13 35.05,56.13 | 35.05,56.13 36.07,56.13 37.34,57.4 37.34,58.83 REF_SEL_A.2
REF_B_INPUT
  Top 0.254: REF_SEL_B.2 37.93,44.79 35.05,41.91 | 35.05,41.91 35.05,40.07 SHUNTMON-B.6 | SHUNTMON-B.7 34.47,41.91 35.05,41.91
REF_INPUT  (via drill 0.5)
  Top 0.254: v43.69,52.07 43.69,48.26 40.46,45.03 REF_SEL_B.3 | 43.69,52.32 v43.69,52.07 | v43.69,52.07 44.01,52.07 44.01,52 R10.1 R11.2 48.77,44.96 v53.85,44.96 | MCP3208.5 68.12,49.33 v61.72,42.93
  Bottom 0.254: v43.69,52.07 43.69,54.36 40.13,57.91 40.13,58.83 REF_SEL_A.3 | v61.72,42.93 59.94,41.15 53.85,41.15 v53.85,44.96
RESTESP
  Top 0.254: ESP-12.9 C21.1 64.43,10.33 65.28,11.18 69,11.18 R19.1
SCL  (via drill 0.5)
  Top 0.254: ESP-12.5 55.85,14.89 v57.66,13.08 | v71.37,16.51 71.94,15.57 72.58,15.08 PCF8523.6
  Bottom 0.254: v57.66,13.08 57.66,8.38 59.69,6.35 63.75,6.35 63.75,4.83 65.02,3.56 69.34,3.56 69.85,4.06 69.85,15.24 71.12,16.51 v71.37,16.51
SDA  (via drill 0.5)
  Top 0.254: ESP-12.6 55.69,12.89 56.64,11.94 56.77,11.9 v56.87,11.8 | v70.87,14.22 70.87,15.24 69.85,16.26 69.85,17.21 70.55,17.91 73.24,17.91 PCF8523.5
  Bottom 0.254: v56.87,11.8 56.87,8.03 59.18,5.71 63.12,5.71 63.12,4.15 64.35,2.92 70.1,2.92 71.37,4.19 71.37,12.95 70.87,13.46 v70.87,14.22
SOURCE-POS-A
  Top 0.254: R14.2 28.96,50.04
  Top 0.406: 32.26,50.04 28.96,50.04 25.91,50.04 arc90 25.4,49.53 22.61,49.53 | 32.26,50.04 33.69,50.04 33.82,49.91 SHUNTMON-A.1 | C25.1 32.26,50.04 | J2.1 J2.2 J2.3 | J2.3 9.68,50.07 | SCREW1.3 22.61,49.53 | 22.61,49.53 10.16,49.53 arc-90 J2.3
  Top 2.54: J2.1 J2.3 | J2.2 7.11,47.63 U$3.P$1
  Bottom 1.016: J2.3 10.41,50.04 arc90 12.19,51.82 12.19,60.52 arc90 PWR.3
SOURCE-POS-B
  Top 0.254: R1.2 28.96,36.07
  Top 0.406: 32,36.07 28.96,36.07 25.91,36.07 arc90 25.4,35.56 22.61,35.56 | 32,36.07 33.82,36.07 SHUNTMON-B.1 | C6.1 32,36.07 | J3.1 4.83,35.81 5.08,36.07 J3.2 J3.3 arc90 10.16,35.56 22.61,35.56 | 22.61,35.56 SCREW2.3
  Top 2.54: J3.1 J3.3 9.68,36.1 | J3.2 7.11,33.58 U$1.P$1
  Bottom 1.016: J3.1 3.3,36.07 arc-90 1.65,37.72 1.65,55.62 arc-90 PWR.1
VSENSEA
  Top 0.254: 28.96,31.84 R1.1 | 28.96,31.84 36.42,31.84 36.96,32.38 44.74,32.38 57.69,45.34 62.71,45.34 67.98,50.61 71.82,50.61 MCP3208.4 | 28.96,31.84 R2.2
VSENSEB
  Top 0.254: 28.96,44.96 R15.2 28.96,45.72 | R14.1 28.96,45.72 | MCP3208.2 69.03,53.14 68.33,53.85 43.18,53.85 41.91,52.58 41.91,48.01 40.64,46.74 34.04,46.74 33.02,45.72 28.96,45.72
(copper drawn outside any net)
  shapes: Top area x4

### Text on the board
tPlace: VSENSE-A | VSENSE-B | MicroSD
bPlace: emonDC | wireless energy monitoring node | Technology that helps us live within ecological limits | Designed in North Wales UK by Megni | Lead free PCB - RoHS components | Designed in | OpenEnergyMonitor.org | North Wales | Made in UK | Node: | Open-Hardware | Format MicroSD / card to FAT32. / Place blank 'datalog.txt' / file there.
tNames: I1 | 470uF | 100uF | 16V | 80V | 330uH | A | B | USB_PWR | UNI | BI | - | LOAD | D1 | A | GND | LMP | + | SOURCE | UNI | BI | - | LOAD | B | GND | LMP | adc channels / 6, 7, 8 | + | disconnect module / before FTDI flash | SOURCE | LCD | BOOT- / LOADER / MODE | J1 | TX / RX | RF to ESP / (dis)connect | CRYSTAL 8x3.8mm / 32KHz
tSilk: 4.7V | 5.0V | 4.7V | RFM69Pi / RF MODULE | GND | 5V | Tx | Rx | RST | GND | GND | 16 | 12 | 13 | 14 | PWR | emonDCduo | Wireless Energy / Monitoring Node | v1.1 Dec 2017 by DB
_tsilk: Designed in | North Wales | Made in UK
_bsilk: SMT V0.6 rev3 | emonTx | wireless energy monitoring node | SMT V0.6 rev3 | emonTx | SMT V0.6 rev3 | emonTx | Technology that helps us live within ecological limits | wireless energy monitoring node | wireless energy monitoring node | Designed in North Wales UK by Glyn Hudson & Trystan Lea | Technology that helps us live within ecological limits | Technology that helps us live within ecological limits | Designed in North Wales UK by Glyn Hudson & Trystan Lea | 165mm ant | 433Mhz | Designed in North Wales UK by Glyn Hudson & Trystan Lea | 165mm ant | 165mm ant | 433Mhz | 433Mhz | 868Mhz | 82mm ant | 82mm ant | 82mm ant | 868Mhz | 868Mhz | 78mm ant | 915Mhz | 78mm ant | 915Mhz | 78mm ant | 915Mhz | 165mm ant | 433Mhz | 82mm ant | 868Mhz | 78mm ant | 915Mhz